# EAGLE design TemperatureHumidiy Pro (EAGLE 5.10)
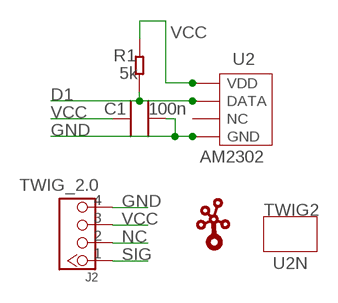
[diagram p0: schematic, sheet 1]

## Parts
C1  100n  C0603  [0603]
J2  TWIG_2.0  [2.0_1X4]
R1  5k  R0603  [0603]
TWIG2  U2N  [U2N]
U2  AM2302  [AM2302]
U$1  TWIGLOGOTWIGLOGO_SMALL  [TWIGLOGO_SMALL]

## Nets
D1: R1.1 U2.P$2(DATA)
GND: C1.2 J2.4 U2.P$4(GND)
NC: J2.2
SIG: J2.1
VCC: C1.1 J2.3 R1.2 U2.P$1(VDD)
Unconnected: U2.P$3(NC)

## Library data of the parts
C1 = CPT_SMD:C0603; C0603: 100N
J2 = CONNECTER:TWIG_2.0
R1 = CPT_SMD:R0603
TWIG2 = twig_template1:U2N
U2 = sensor:AM2302
U$1 = seeedleo:TWIGLOGO

## Board
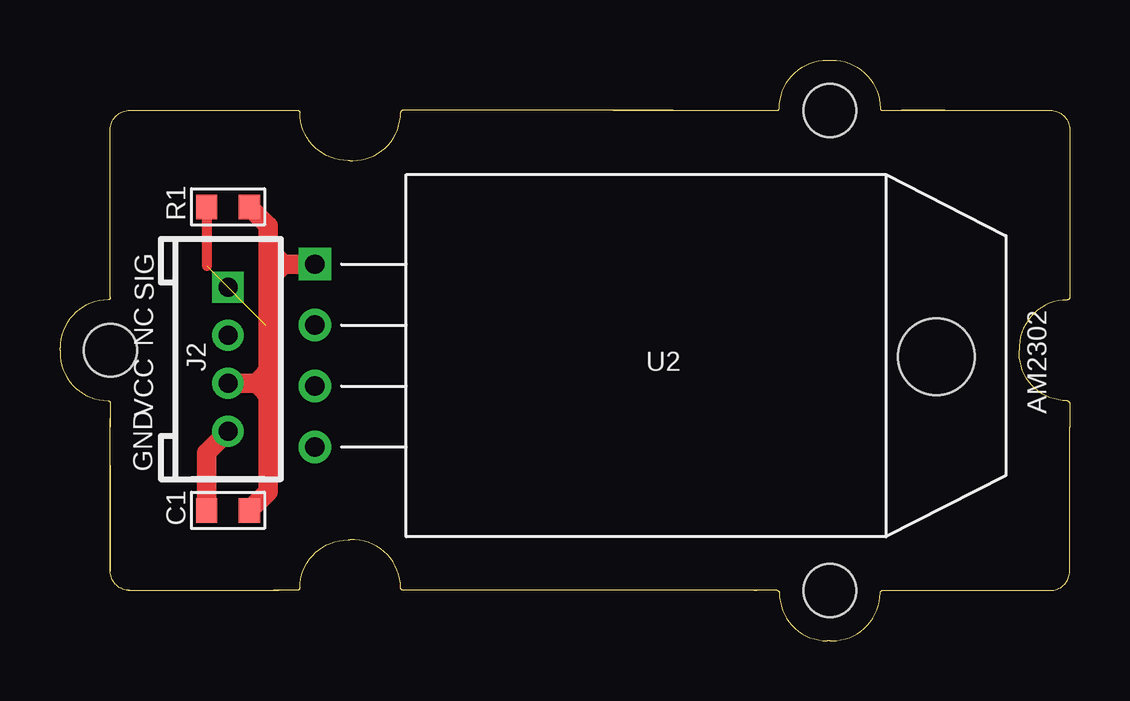
[diagram p1: board, top side]
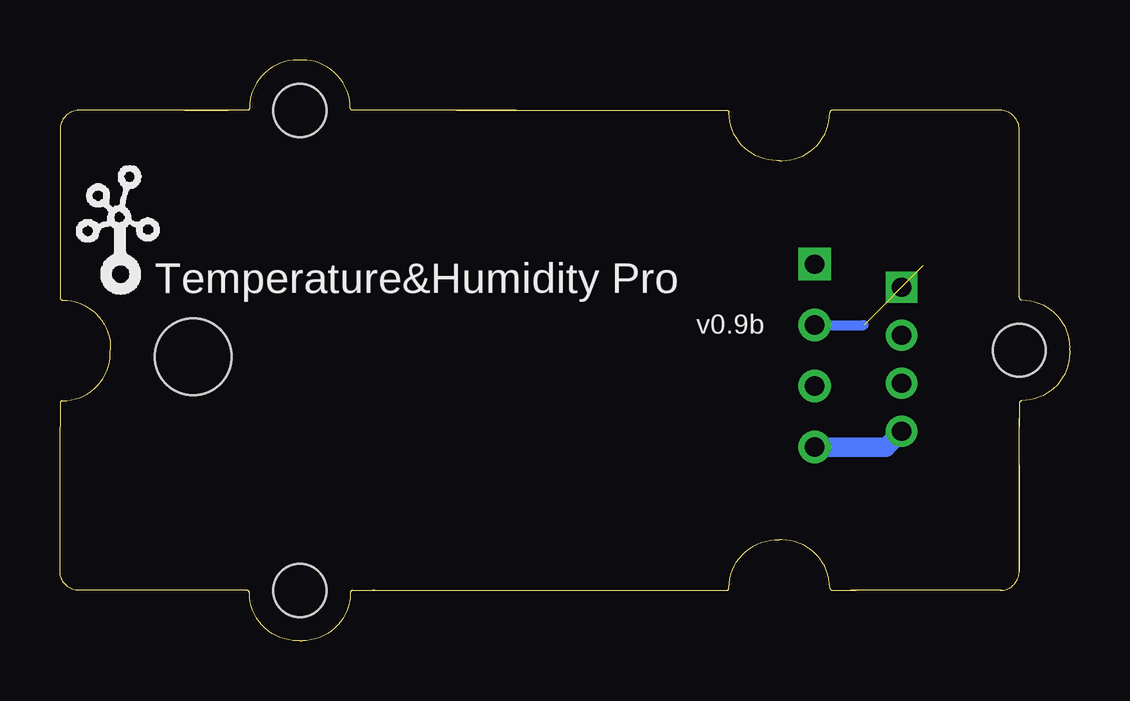
[diagram p2: board, bottom side, seen from below]

Size 42.09 x 24.2 mm. Coordinates in mm from the lower left corner, seen from the top.
Copper layers (1*16): Top 0.035mm / dielectric 1.5mm / Bottom 0.035mm
Design rules "SeeedStudio_rule_no_angle_090911": minimum track width 6mil, minimum drill 12mil, track to track 6mil, track to pad 6mil, pad to pad 6mil, via to via 6mil, smd to smd 0mil, copper to edge 10mil, drill to drill 10mil, minimum pad ring 10mil, minimum via ring 6mil, stop-mask expansion 2mil, vias tented up to drill 100mil, thermal gap 10mil
Holes 3.2 mm at 36.53,11.84

### Footprints (pad centres in the part's own frame; a part is rotated, then mirrored left to right if it is on the bottom)
0603 = smd 0.889 x 1.016: 1 -0.889,0; 2 0.889,0
2.0_1X4 = drill 0.8 pad 1.27 square: 1 -3,0 | drill 0.8 pad 1.27 round: 2 -1,0; 3 1,0; 4 3,0
U2N = hole 2.2: 10.453,-10.42; 10.453,9.58; -19.535,-0.415
AM2302 = drill 0.8 pad 1.35 square: P$1 -3.81,-13.8 | drill 0.8 pad 1.35 round: P$2 -1.27,-13.8; P$3 1.27,-13.8; P$4 3.81,-13.8

### Placement (x,y rotation side)
C1  7,5.43 180 top
J2  7,11.73 270 top
R1  7,18.08 0 top
TWIG2  21.64,12.52 0 top
U2  24.43,11.89 270 top
U$1  41.8,14.3 0 bottom

### Tracks (layer width: path | path; a pad name or v marks a point on that pad's centre or on a via)
D1  (1 unrouted)
  Top 0.406: R1.1 6.12,15.62
  Bottom 0.406: U2.P$2 8.58,13.16
GND
  Top 0.813: C1.2 6.12,7.84 J2.4
  Bottom 0.813: U2.P$4 7.66,8.08 J2.4
VCC
  Top 0.813: C1.1 8.68,6.22 8.68,10.74 | 8.18,10.73 8.67,10.73 8.68,10.74 | 8.16,10.73 J2.3 | 8.16,10.73 8.55,11.12 | 8.18,10.73 8.16,10.73 | 8.18,10.73 8.55,10.36 | 7.92,18.11 R1.2 8.68,17.3 8.68,16.33 | 8.68,16.33 8.68,15.57 | 8.68,15.06 8.68,10.74 | 9.32,15.7 8.81,15.7 8.68,15.57 | U2.P$1 9.32,15.7 | 9.32,15.7 8.68,15.06 | 8.68,15.06 8.68,15.57 | 9.32,15.7 8.68,16.33

### Text on the board
tPlace: SIG | VCC | NC | GND
bPlace: Temperature&Humidity Pro | v0.9b